# EAGLE design Jar_of_Fireflies (EAGLE 6.3)
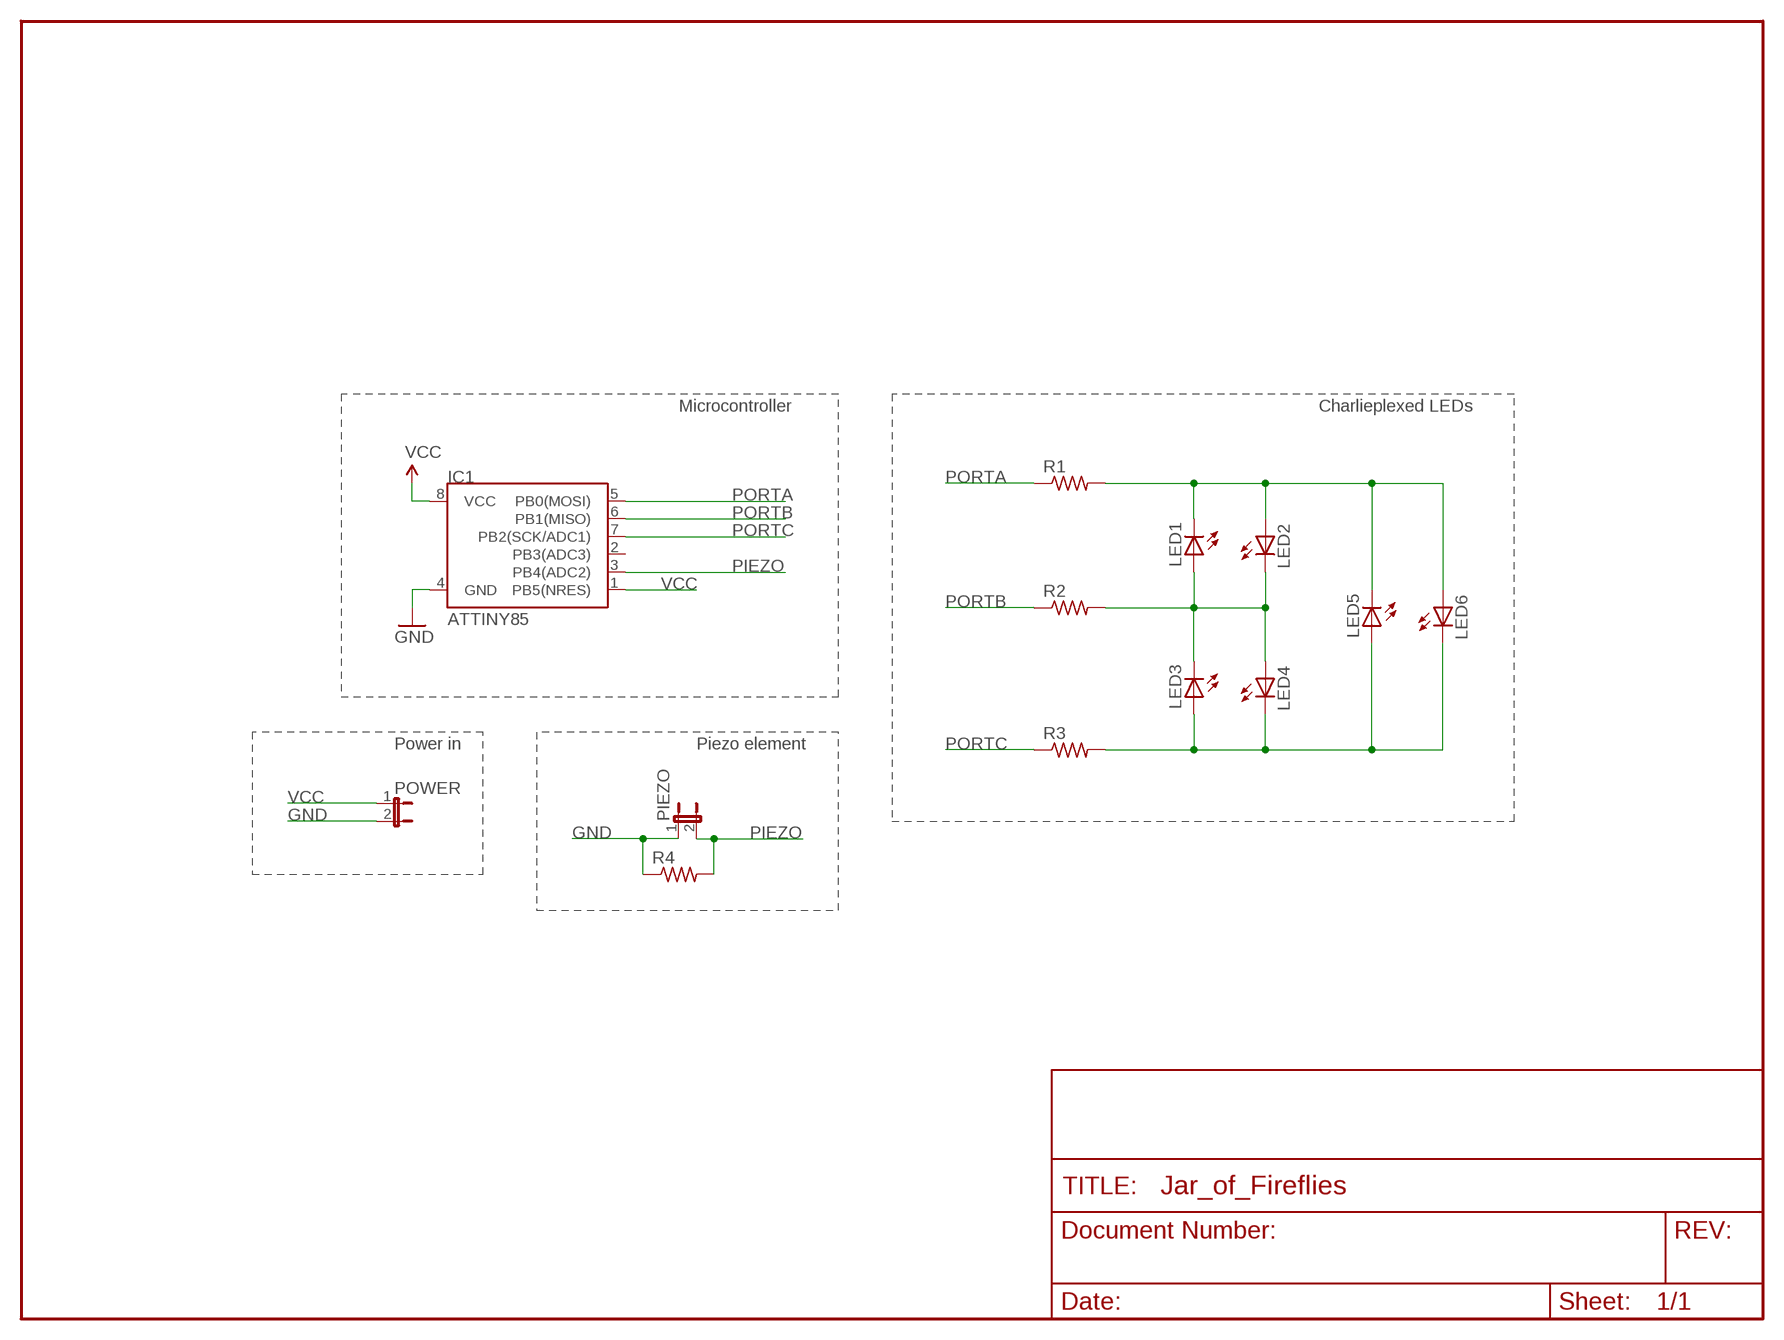
[diagram p0: schematic, sheet 1]

## Parts
IC1  ATTINY85  ATTINY45DIP8  [DIP08]
LED1  LED5MM  [LED5MM]
LED2  LED5MM  [LED5MM]
LED3  LED5MM  [LED5MM]
LED4  LED5MM  [LED5MM]
LED5  LED5MM  [LED5MM]
LED6  LED5MM  [LED5MM]
PIEZO  JUMPER-2PTH  [1X02]
POWER  JUMPER-2PTH  [1X02]
R1  R-US_0207/2V  [0207/2V]
R2  R-US_0204/7  [0204/7]
R3  R-US_0207/2V  [0207/2V]
R4  R-US_0204/7  [0204/7]

## Nets
GND: IC1.4(GND) PIEZO.1 POWER.2 R4.1
N$1: LED1.A LED2.K(C) LED3.K(C) LED4.A R2.2
N$2: LED1.K(C) LED2.A LED5.K(C) LED6.A R1.2
N$3: LED3.A LED4.K(C) LED5.A LED6.K(C) R3.2
PIEZO: IC1.3(PB4(ADC2)) PIEZO.2 R4.2
PORTA: IC1.5(PB0(MOSI)) R1.1
PORTB: IC1.6(PB1(MISO)) R2.1
PORTC: IC1.7(PB2(SCK/ADC1)) R3.1
VCC: IC1.1(PB5(NRES)) IC1.8(VCC) POWER.1
Unconnected: IC1.2(PB3(ADC3))

## Notes on the sheet
- Microcontroller | Charlieplexed LEDs
- Power in | Piezo element

## Library data of the parts
IC1 = SparkFun:ATTINY45: Atmel ATTiny45
LED1-LED6 = SparkFun:LED: LEDs Standard schematic elements and footprints for 5mm, 3mm, 1206, and 0603 sized LEDs. 5mm - Spark Fun Electronics SKU : COM-00529 (and others)
PIEZO POWER = SparkFun:JUMPER-2: Jumper Basic 0.1" spaced jumper. Use with breakaway headers.
R1-R4 = resistor:R-US_: RESISTOR, American symbol

## Board
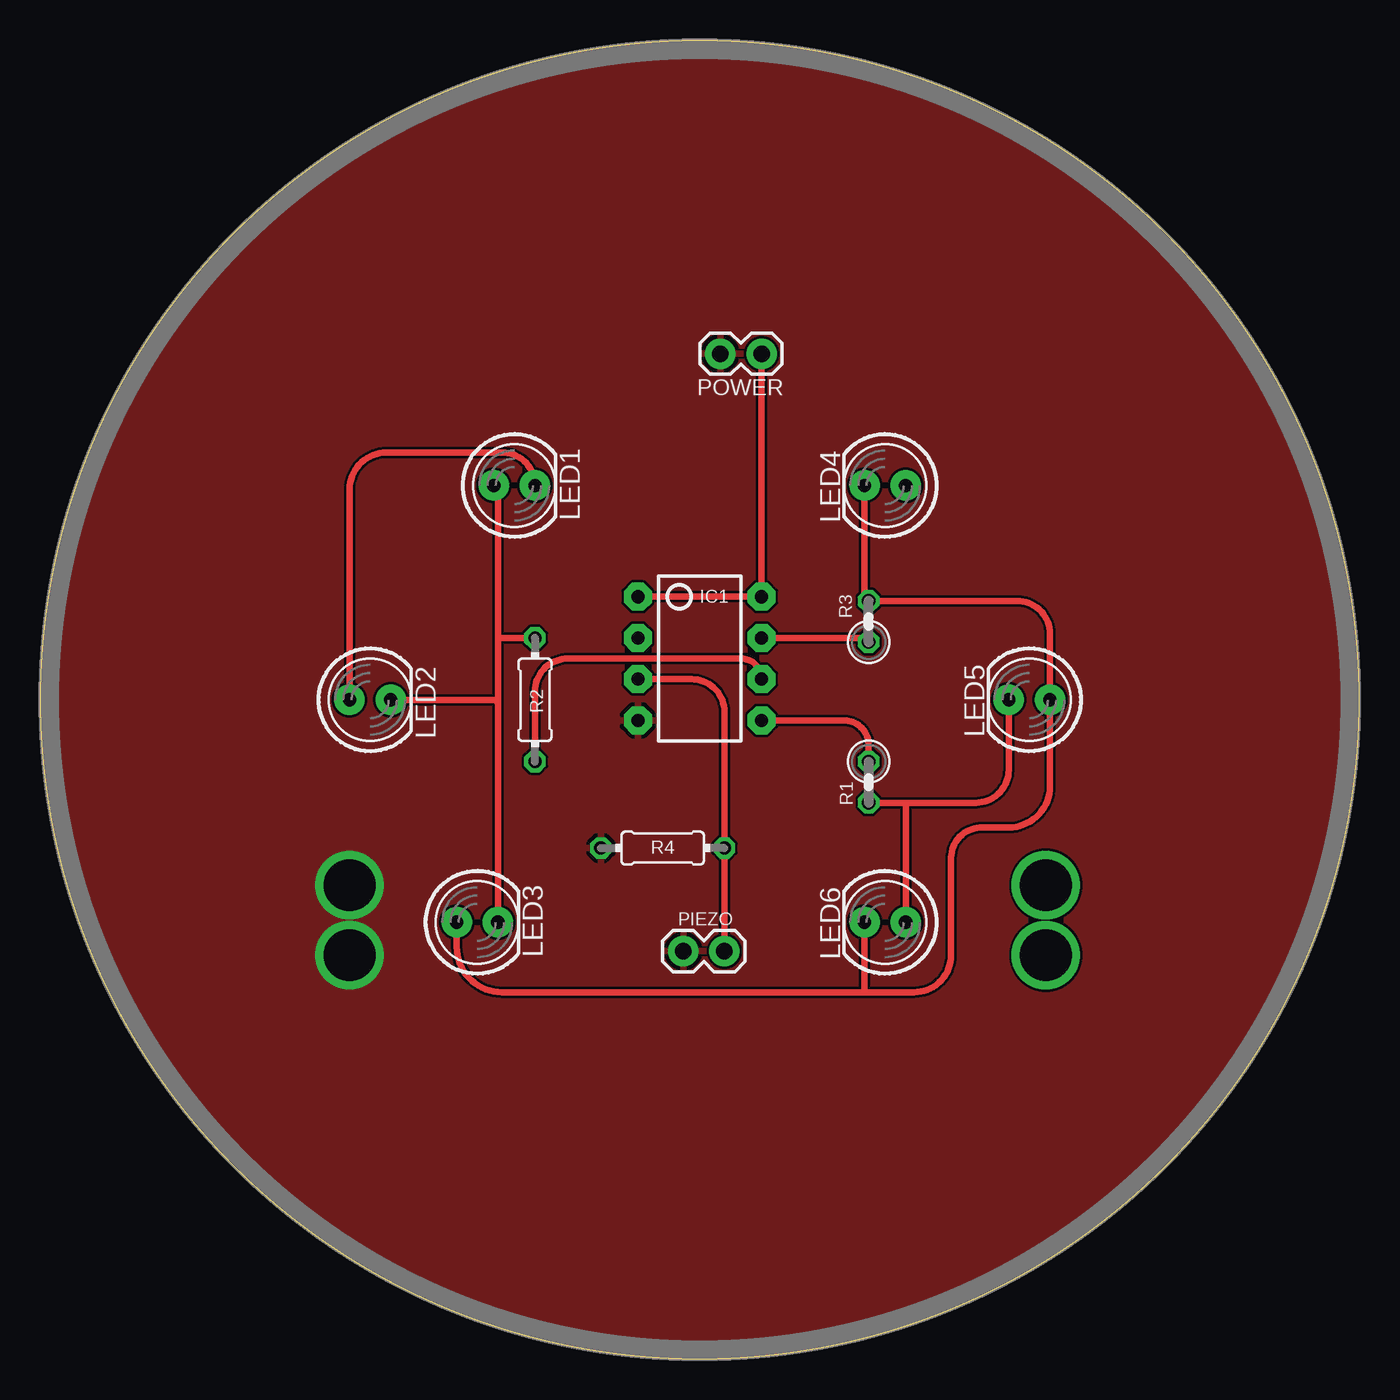
[diagram p1: board, top side]
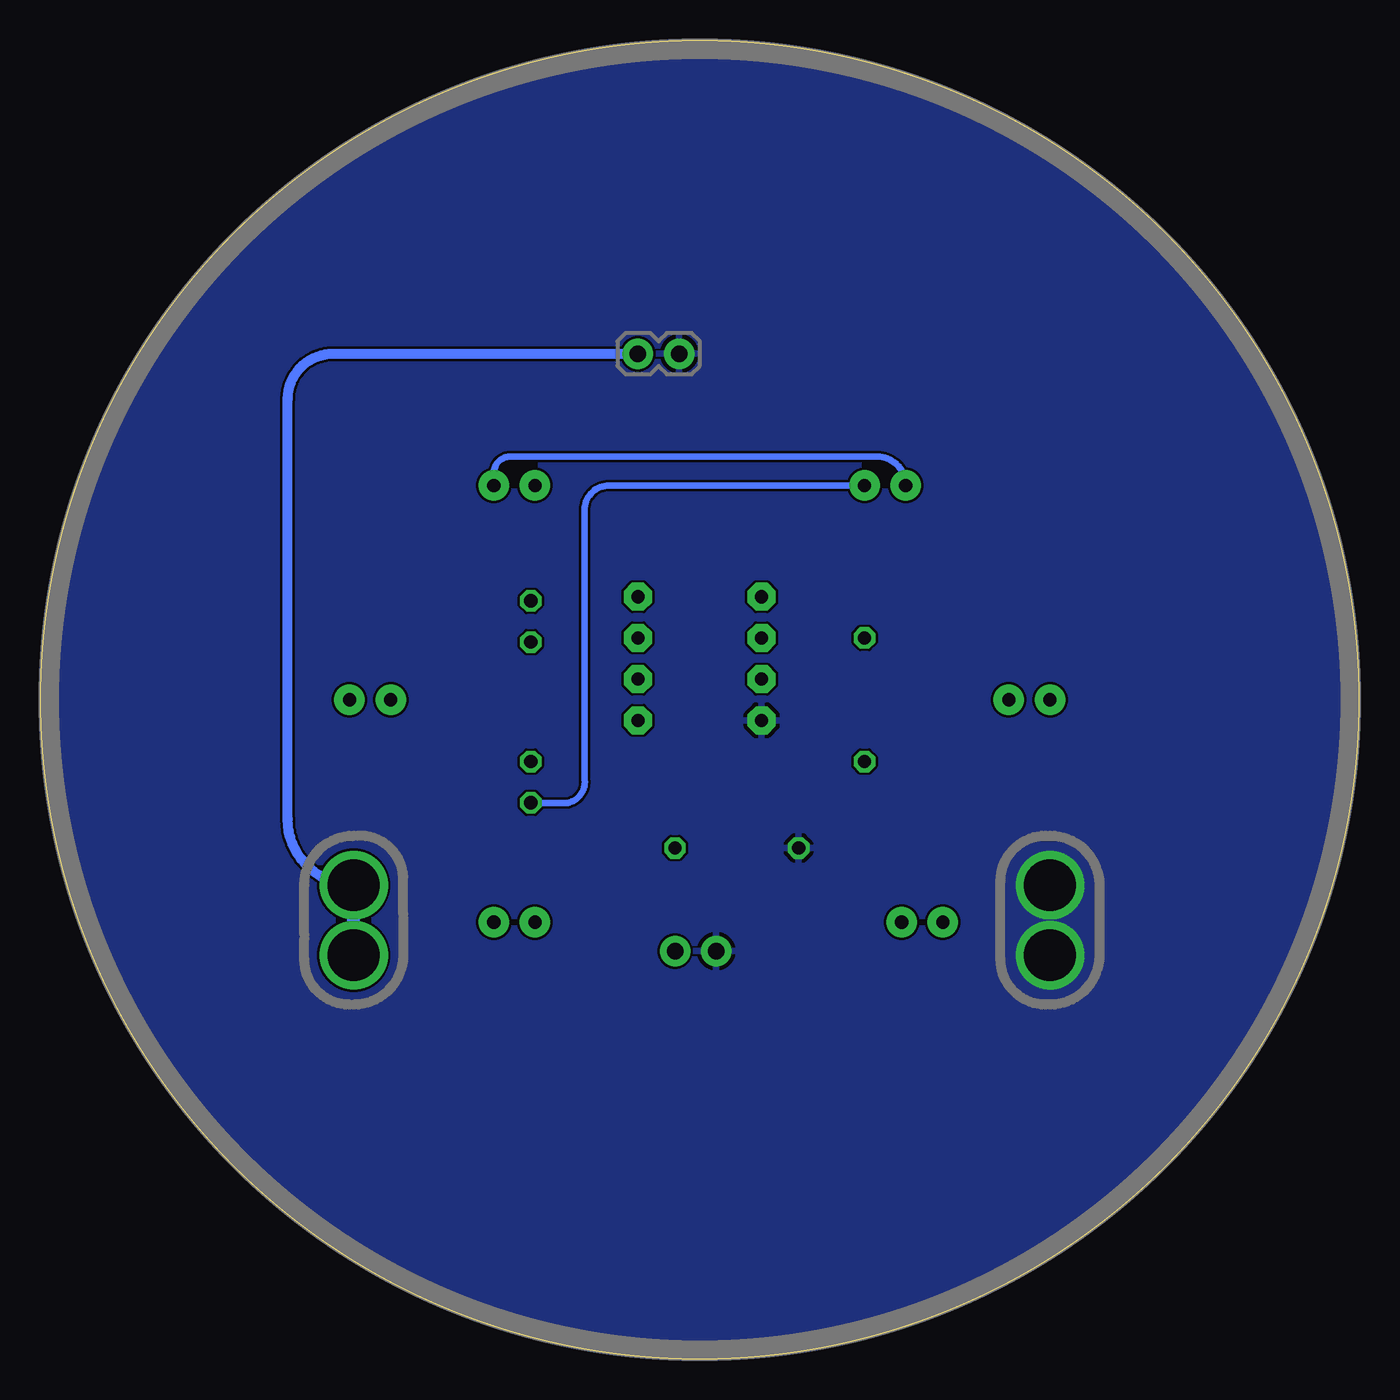
[diagram p2: board, bottom side, seen from below]

Size 81.28 x 81.28 mm. Coordinates in mm from the lower left corner, seen from the top.
Outline: circle at 40.64,40.64 radius 40.64
Copper layers (1*16): Top 0.035mm / dielectric 1.5mm / Bottom 0.035mm
Design rules "Fusion_eagle_rule_v1.1": minimum track width 6mil, minimum drill 12mil, track to track 6mil, track to pad 6mil, pad to pad 6mil, via to via 6mil, smd to smd 0mil, copper to edge 10mil, drill to drill 10mil, minimum pad ring 10mil, minimum via ring 6mil, stop-mask expansion 2mil, vias tented up to drill 100mil, thermal gap 10mil

### Footprints (pad centres in the part's own frame; a part is rotated, then mirrored left to right if it is on the bottom)
DIP08 = drill 0.813 pad 1.727 octagon: 1 -3.81,-3.81; 2 -1.27,-3.81; 3 1.27,-3.81; 4 3.81,-3.81; 5 3.81,3.81; 6 1.27,3.81; 7 -1.27,3.81; 8 -3.81,3.81
LED5MM = drill 0.813 pad 1.88: A -1.27,0; K 1.27,0
1X02 = drill 1.016 pad 1.88: 1 0,0; 2 2.54,0
0207/2V = drill 0.813 octagon: 1 -1.27,0; 2 1.27,0
0204/7 = drill 0.813 octagon: 1 -3.81,0; 2 3.81,0

### Placement (x,y rotation side)
IC1  40.64,43.18 270 top
LED1  29.21,53.85 0 top
LED2  20.32,40.64 0 top
LED3  26.92,26.92 0 top
LED4  52.07,53.85 180 top
LED5  60.96,40.64 180 top
LED6  52.07,26.92 180 top
PIEZO  39.62,25.15 0 top
POWER  44.45,61.98 180 top
R1  51.05,35.56 270 top
R2  30.48,40.64 90 top
R3  51.05,45.47 90 top
R4  38.35,31.5 0 top

### Tracks (layer width: path | path; a pad name or v marks a point on that pad's centre or on a via)
GND  (via drill 3.2 pad 3.81)
  other vias: 19.05,29.21 19.05,24.89
  pour Top: 0,0.25 82.04,0 82.04,81.79 0,81.79
  pour Bottom: 0,0.25 82.04,0 82.04,81.79 0,81.79
N$1
  Top 0.406: LED3.K 28.19,40.39 | 28.19,40.39 28.19,44.45 | 28.19,44.45 28.19,53.59 arc90 LED1.A | LED2.K 27.94,40.64 arc-90 28.19,40.39 | R2.2 28.19,44.45
  Bottom 0.406: LED1.A arc-90 29.72,55.63 52.32,55.63 arc-90 53.34,54.61 LED4.A
N$2
  Top 0.406: LED2.A 19.05,53.59 arc-90 21.34,55.88 28.45,55.88 arc-90 LED1.K | LED5.K 59.69,36.32 arc-90 57.66,34.29 53.59,34.29 | 53.59,34.29 R1.2 | LED6.A 53.34,34.04 arc-90 53.59,34.29
  Bottom 0.406: LED1.K 46.23,53.85 arc-90 47.75,52.32 47.75,35.81 arc90 48.77,34.29 R1.2
N$3
  Top 0.406: LED4.K 50.8,46.99 arc90 R3.2 60.2,46.74 arc-90 62.23,44.7 LED5.A 62.23,35.31 arc-90 59.69,32.77 57.91,32.77 arc90 56.13,30.73 56.13,24.89 arc-90 53.85,22.61 50.8,22.61 | 50.8,22.61 28.45,22.61 arc-90 25.65,25.4 LED3.A | LED6.K 50.8,22.61
PIEZO
  Top 0.406: PIEZO.2 R4.2 42.16,39.88 arc90 40.13,41.91 IC1.3
PORTA
  Top 0.406: IC1.5 49.53,39.37 arc-90 51.05,37.85 R1.1
PORTB
  Top 0.406: R2.1 30.48,41.15 arc-90 32.51,43.18 43.18,43.18 arc-90 IC1.6
PORTC
  Top 0.406: IC1.7 50.8,44.45 arc-90 R3.1
VCC  (via drill 3.2 pad 3.81)
  Top 0.406: IC1.1 IC1.8 POWER.1
  Bottom 0.61: v61.98,29.21 arc90 66.04,33.27 66.04,59.18 arc90 63.25,61.98 POWER.1
  Bottom 0.813: v61.98,24.89 v61.98,29.21

### Text on the board
tDocu: 100ohm | 100ohm | 100ohm
bDocu: JAR OF | - | + | POWER | FIREFLIES | REV A | + | - | OSHW | Designed by Jason Webb | http://jason-webb.info